# Altium project Main.PrjPCB
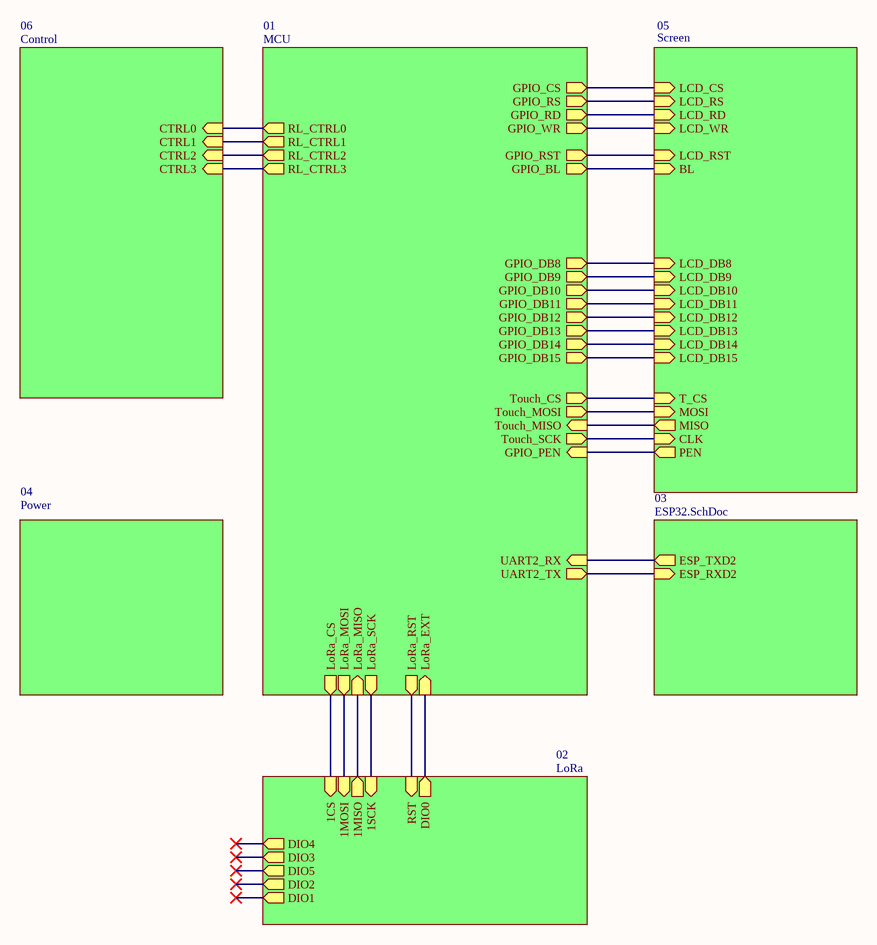
[diagram p0: Main.SchDoc]
7 sheets, 88 parts. Net scope: hierarchical (ports join the sheet entries above them; power ports are global).
Board file: GATEWAY_PCB.PcbDoc
Sheets:
  Main.SchDoc
    01 = MCU.SchDoc
    02 = LoRa.SchDoc
    04 = Power.SchDoc
    05 = Screen.SchDoc
    03 = ESP32.SchDoc
    06 = Control.SchDoc

## Sheet Main.SchDoc: =ProjectName
size A4; CheckedBy: DatNB; Author: Ven; CompanyName: Nacentech; Organization: IMET

### Sub-sheets
01 = MCU: GPIO_DB10 (out), GPIO_PEN (in), GPIO_DB13 (out), UART2_RX (in), GPIO_DB12 (out), LoRa_EXT (in), GPIO_WR (out), GPIO_RD (out), LoRa_RST (out), GPIO_DB14 (out), LoRa_CS (out), GPIO_BL (out), Touch_CS (out), Touch_SCK (out), GPIO_CS (out), LoRa_MOSI (out), LoRa_SCK (out), Touch_MOSI (out), GPIO_DB8 (out), LoRa_MISO (in), GPIO_RST (out), GPIO_DB15 (out), UART2_TX (out), GPIO_DB11 (out), GPIO_DB9 (out), GPIO_RS (out), Touch_MISO (in), RL_CTRL3 (out), RL_CTRL0 (out), RL_CTRL1 (out), RL_CTRL2 (out)
02 = LoRa: 1MOSI (in), DIO5 (out), DIO3 (out), DIO4 (out), DIO2 (out), 1SCK (in), DIO1 (out), DIO0 (out), RST (in), 1CS (in), 1MISO (out)
03 = ESP32.SchDoc: ESP_TXD2 (out), ESP_RXD2 (in)
04 = Power: no entries
05 = Screen: CLK (in), LCD_DB15 (in), MISO (out), T_CS (in), LCD_DB12 (in), LCD_DB9 (in), LCD_DB13 (in), BL (in), LCD_RS (in), LCD_DB10 (in), LCD_DB8 (in), PEN (out), LCD_RD (in), MOSI (in), LCD_DB14 (in), LCD_DB11 (in), LCD_WR (in), LCD_RST (in), LCD_CS (in)
06 = Control: CTRL0 (in), CTRL2 (in), CTRL1 (in), CTRL3 (in)

### Nets
NetJ6_1: sheet 01/GPIO_CS, sheet 05/LCD_CS
NetJ6_2: sheet 01/GPIO_WR, sheet 05/LCD_WR
NetJ6_3: sheet 01/GPIO_RST, sheet 05/LCD_RST
NetJ6_8: sheet 01/GPIO_DB9, sheet 05/LCD_DB9
NetJ6_9: sheet 01/GPIO_DB11, sheet 05/LCD_DB11
NetJ6_10: sheet 01/GPIO_DB13, sheet 05/LCD_DB13
NetJ6_11: sheet 01/GPIO_DB15, sheet 05/LCD_DB15
NetJ6_12: sheet 01/GPIO_BL, sheet 05/BL
NetJ6_15: sheet 01/Touch_MISO, sheet 05/MISO
NetJ6_16: sheet 01/GPIO_PEN, sheet 05/PEN
NetJ6_17: sheet 01/Touch_CS, sheet 05/T_CS
NetJ6_18: sheet 01/Touch_SCK, sheet 05/CLK
NetJ6_20: sheet 01/Touch_MOSI, sheet 05/MOSI
NetJ6_25: sheet 01/GPIO_DB14, sheet 05/LCD_DB14
NetJ6_26: sheet 01/GPIO_DB12, sheet 05/LCD_DB12
NetJ6_27: sheet 01/GPIO_DB10, sheet 05/LCD_DB10
NetJ6_28: sheet 01/GPIO_DB8, sheet 05/LCD_DB8
NetJ6_33: sheet 01/GPIO_RD, sheet 05/LCD_RD
NetJ6_34: sheet 01/GPIO_RS, sheet 05/LCD_RS
NetR14_1: sheet 01/RL_CTRL0, sheet 06/CTRL0
NetR15_1: sheet 01/RL_CTRL1, sheet 06/CTRL1
NetR18_1: sheet 01/RL_CTRL2, sheet 06/CTRL2
NetR19_1: sheet 01/RL_CTRL3, sheet 06/CTRL3
NetU1_27: sheet 01/UART2_TX, sheet 03/ESP_RXD2
NetU1_28: sheet 01/UART2_RX, sheet 03/ESP_TXD2
NetU2_4: sheet 01/LoRa_RST, sheet 02/RST
NetU2_5: sheet 01/LoRa_EXT, sheet 02/DIO0
NetU2_12: sheet 01/LoRa_SCK, sheet 02/1SCK
NetU2_13: sheet 01/LoRa_MISO, sheet 02/1MISO
NetU2_14: sheet 01/LoRa_MOSI, sheet 02/1MOSI
NetU2_15: sheet 01/LoRa_CS, sheet 02/1CS

### Notes on the sheet
- Project:
- Page Contents:
- Size:
- Date:
- A4
- Checked by:
- Time:
- Revision:
- Sheet
- of
- File:

## Sheet MCU.SchDoc: =ProjectName
size A4; CheckedBy: DatNB; Author: Ven; CompanyName: Nacentech; Organization: IMET
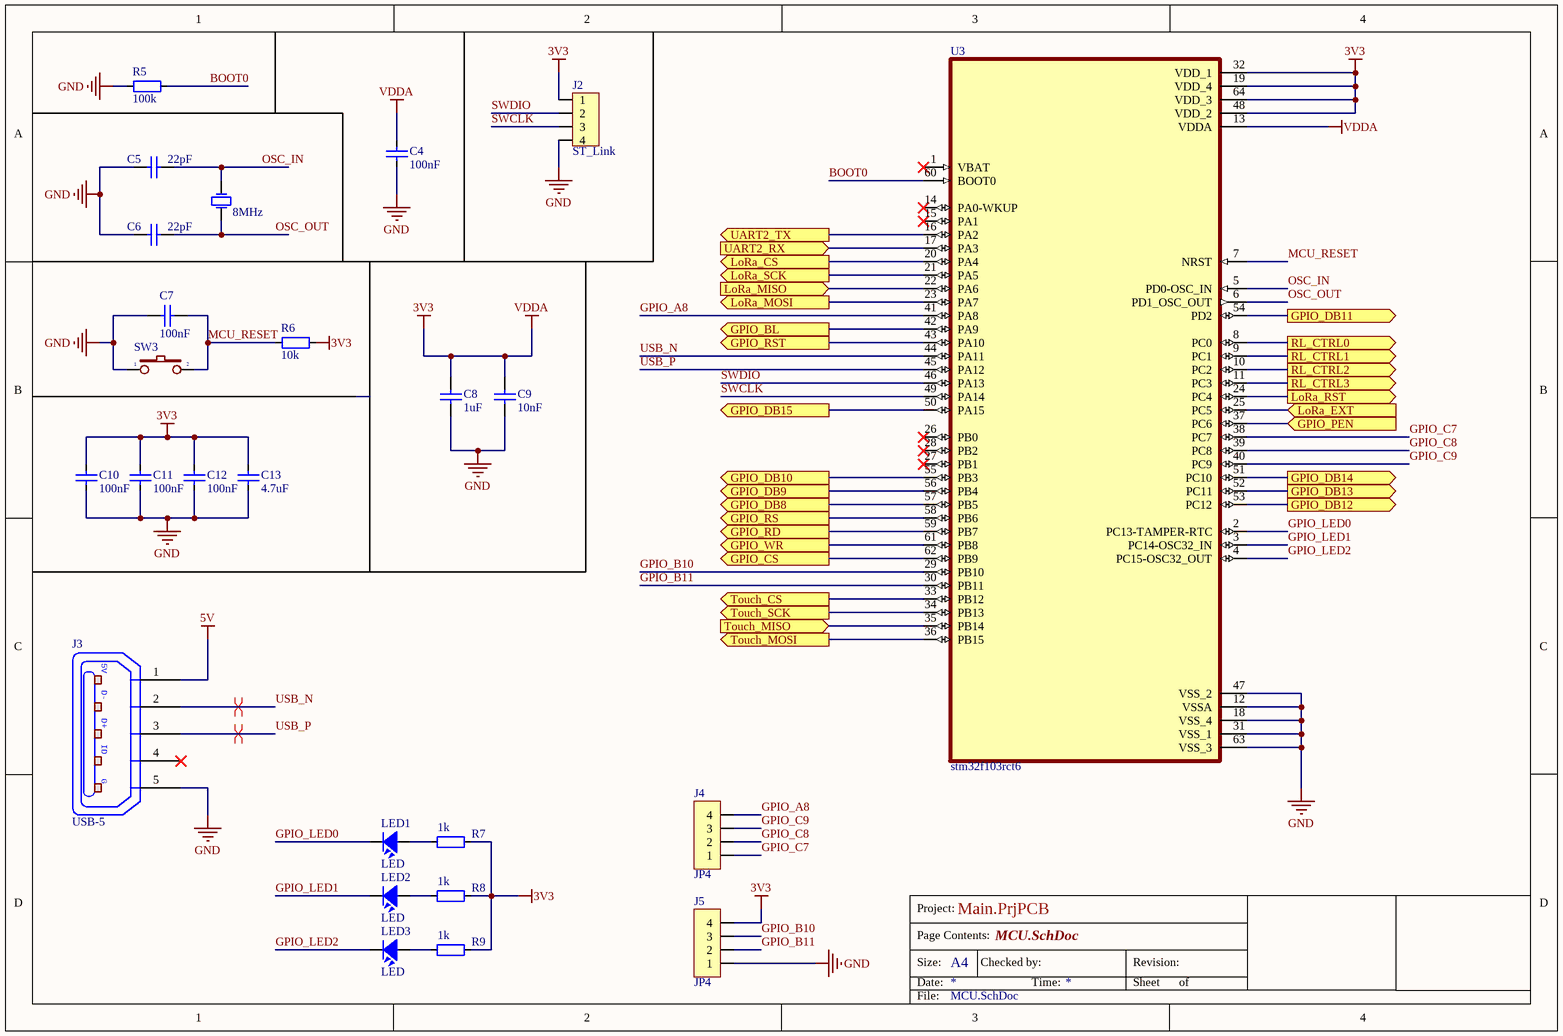
[diagram p1: MCU.SchDoc]

### Parts
C4  100nF  [CAP_0805]
C5  22pF  [CAP_0805]
C6  22pF  [CAP_0805]
C7  100nF  [CAP_0805]
C8  1uF  [CAP_0805]
C9  10nF  [CAP_0805]
C10  100nF  [CAP_0805]
C11  100nF  [CAP_0805]
C12  100nF  [CAP_0805]
C13  4.7uF  [CAP_0805]
J2  ST_Link  [JP4-C1T]
J3  USB-5  [USB-M1]
J4  JP4  [JP4-C1T]
J5  JP4  [JP4-C1T]
LED1  LED  [LED-0805-Red]
LED2  LED  [LED-0805-Green]
LED3  LED  [LED-0805-Blue]
R5  100k  [RES-SMD-0805]
R6  10k  [RES-SMD-0805]
R7  1k  [RES-SMD-0805]
R8  1k  [RES-SMD-0805]
R9  1k  [RES-SMD-0805]
SW3  SW  [SW2]  (value not drawn)
U3  stm32f103rct6  [QFP50P1200X1200X160-64N]
Y1  8MHz  [XTAL]

### Ports
GPIO_BL (out), GPIO_CS (out), GPIO_DB8 (out), GPIO_DB9 (out), GPIO_DB10 (out), GPIO_DB11 (out), GPIO_DB12 (out), GPIO_DB13 (out), GPIO_DB14 (out), GPIO_DB15 (out), GPIO_PEN (in), GPIO_RD (out), GPIO_RS (out), GPIO_RST (out), GPIO_WR (out), LoRa_CS (out), LoRa_EXT (in), LoRa_MISO (in), LoRa_MOSI (out), LoRa_RST (out), LoRa_SCK (out), RL_CTRL0 (out), RL_CTRL1 (out), RL_CTRL2 (out), RL_CTRL3 (out), Touch_CS (out), Touch_MISO (in), Touch_MOSI (out), Touch_SCK (out), UART2_RX (in), UART2_TX (out)

### Nets
3V3: C4.2 C8.2 C9.2 C10.2 C11.2 C12.2 C13.2 J2.1 J5.4 R6.1 R7.1 R8.1 R9.1 U3.13(VDDA) U3.19(VDD_4) U3.32(VDD_1) U3.48(VDD_2) U3.64(VDD_3)  [also labelled VDDA]
5V: J3.1(P1)
GND: C4.1 C5.1 C6.1 C7.1 C8.1 C9.1 C10.1 C11.1 C12.1 C13.1 J2.4 J3.5(P5) J5.1 R5.2 SW3.1 U3.12(VSSA) U3.18(VSS_4) U3.31(VSS_1) U3.47(VSS_2) U3.63(VSS_3)
BOOT0: R5.1 U3.60(BOOT0)
GPIO_A8: J4.4 U3.41(PA8)
GPIO_B10: J5.3 U3.29(PB10)
GPIO_B11: J5.2 U3.30(PB11)
GPIO_C7: J4.1 U3.38(PC7)
GPIO_C8: J4.2 U3.39(PC8)
GPIO_C9: J4.3 U3.40(PC9)
GPIO_LED0: LED1.2 U3.2(PC13-TAMPER-RTC)
GPIO_LED1: LED2.2 U3.3(PC14-OSC32_IN)
GPIO_LED2: LED3.2 U3.4(PC15-OSC32_OUT)
MCU_RESET: C7.2 R6.2 SW3.2 U3.7(NRST)
OSC_IN: C5.2 U3.5(PD0-OSC_IN) Y1.1(OSC1)
OSC_OUT: C6.2 U3.6(PD1_OSC_OUT) Y1.2(OSC2)
SWCLK: J2.3 U3.49(PA14)
SWDIO: J2.2 U3.46(PA13)
USB_N: J3.2(P2) U3.44(PA11)
USB_P: J3.3(P3) U3.45(PA12)
NetJ6_1: U3.62(PB9) ; port GPIO_CS
NetJ6_2: U3.61(PB8) ; port GPIO_WR
NetJ6_3: U3.43(PA10) ; port GPIO_RST
NetJ6_8: U3.56(PB4) ; port GPIO_DB9
NetJ6_9: U3.54(PD2) ; port GPIO_DB11
NetJ6_10: U3.52(PC11) ; port GPIO_DB13
NetJ6_11: U3.50(PA15) ; port GPIO_DB15
NetJ6_12: U3.42(PA9) ; port GPIO_BL
NetJ6_15: U3.35(PB14) ; port Touch_MISO
NetJ6_16: U3.37(PC6) ; port GPIO_PEN
NetJ6_17: U3.33(PB12) ; port Touch_CS
NetJ6_18: U3.34(PB13) ; port Touch_SCK
NetJ6_20: U3.36(PB15) ; port Touch_MOSI
NetJ6_25: U3.51(PC10) ; port GPIO_DB14
NetJ6_26: U3.53(PC12) ; port GPIO_DB12
NetJ6_27: U3.55(PB3) ; port GPIO_DB10
NetJ6_28: U3.57(PB5) ; port GPIO_DB8
NetJ6_33: U3.59(PB7) ; port GPIO_RD
NetJ6_34: U3.58(PB6) ; port GPIO_RS
NetLED1_1: LED1.1 R7.2
NetLED2_1: LED2.1 R8.2
NetLED3_1: LED3.1 R9.2
NetR14_1: U3.8(PC0) ; port RL_CTRL0
NetR15_1: U3.9(PC1) ; port RL_CTRL1
NetR18_1: U3.10(PC2) ; port RL_CTRL2
NetR19_1: U3.11(PC3) ; port RL_CTRL3
NetU1_27: U3.16(PA2) ; port UART2_TX
NetU1_28: U3.17(PA3) ; port UART2_RX
NetU2_4: U3.24(PC4) ; port LoRa_RST
NetU2_5: U3.25(PC5) ; port LoRa_EXT
NetU2_12: U3.21(PA5) ; port LoRa_SCK
NetU2_13: U3.22(PA6) ; port LoRa_MISO
NetU2_14: U3.23(PA7) ; port LoRa_MOSI
NetU2_15: U3.20(PA4) ; port LoRa_CS

Not connected (* = marked no-connect by the designer): J3 4(P4)*; U3 1(VBAT)* 14(PA0-WKUP)* 15(PA1)* 26(PB0)* 27(PB1)* 28(PB2)*

### Layout directives
differential pair: USB_N, USB_P

### Notes on the sheet
- Project:
- Page Contents:
- Size:
- Date:
- A4
- Checked by:
- Time:
- Revision:
- Sheet
- of
- File:
- (in symbol USB-5) 5V; D-; D+; ID; G

### Library data of the parts
C4-C13 = CapSMD: Capacitor; Value: 33p; Published: 8-Jun-2000; LatestRevisionDate: 17-Jul-2002; LatestRevisionNote: Re-released for DXP Platform.; PackageReference: RAD-0.3; Publisher: Altium Limited
J2 = Header4: Header IDC, 4 x 1 Pin Vertical 2.54mm Pitch (Non-Boxed, Male); Manufacturer: W¨¹rth Elektronik eiSos GmbH; partNo: 613002143121; ComponentLink1 Description: Manufacturer; ComponentLink2 Description: Datasheet; NoPins: 02; Created Date: 29 March 2013; ComponentLink1URL: http://www.we-online.com; ComponentLink2URL: http://katalog.we-online.de/em/datasheet/6130xx143121.pdf; Created by: Karrer Zheng
J3 = USB-5: Manufacturer: FCI; Manufacturer Part Number: 10118193-0001LF; Connector Type: USB - micro B; Number of Contacts: 5; Gender: Receptacle; Specifications: USB 2.0; .Creator: MM; .Checked PCB: RF; Supplier 1: Digi-Key; RoHS: RoHS Compliant; Category: Connectors, Interconnects; Stock 1: 28642; Pricing 1: 1=0.46, 10=0.433, 25=0.3712, 50=0.3156, 100=0.3032, 250=0.27224, 500=0.25988 (USD); Packaging: Cut Tape (CT); Mounting Type: Surface Mount, Right Angle, Horizontal; Features: Shielded, Solder Retention; Ingress Protection: -; ComponentLink1URL: http://portal.fciconnect.com/Comergent//fci/drawing/10118193.pdf; ComponentLink1Description: http://portal.fciconnect.com/Comergent//fci/drawing/10118193.pdf; Supplier Part Number 1: 609-4616-1-ND; .Checked SCH: MM
J4 J5 = JP4: WR-PHD 2.54 mm Angled Socket Header; Manufacturer: W¨¹rth Elektronik eiSos GmbH; partNo: 613004143121; ComponentLink1 Description: Manufacturer; ComponentLink2 Description: Datasheet; NoPins: 04; Created Date: 29 March 2013; ComponentLink1URL: http://www.we-online.com; ComponentLink2URL: http://katalog.we-online.de/em/datasheet/6130xx143121.pdf; Created by: Karrer Zheng
LED1-LED3 = LED: LED Single colour Green and Red; Value: LED 3 ly Single Colour
R5-R9 = Resistor - SMD: Resistor; Manufacturer: Generic Components; Class: Passive; Published: 08/06/2000; Publisher: Altium Hobart Technology Centre
SW3 = SW2: Switch button 2 pin; Value: SW chip 2 pin
Y1 = XTAL: Crystal Oscillator; Published: 8-Jun-2000; LatestRevisionDate: 17-Jul-2002; LatestRevisionNote: Re-released for DXP Platform.; PackageReference: R38; Publisher: Altium Limited

## Sheet LoRa.SchDoc: =ProjectName
size A4; CheckedBy: DatNB; Author: Ven; CompanyName: Nacentech; Organization: IMET
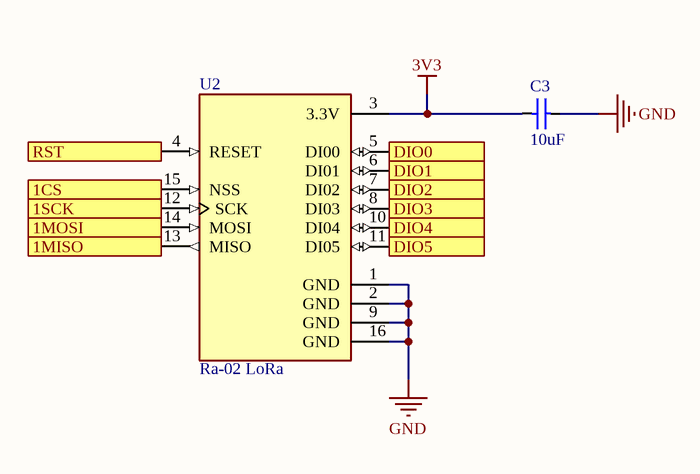
[diagram p2: LoRa.SchDoc]

### Parts
C3  10uF  [CAP_0805]
U2  Ra-02 LoRa  [Ra-02]

### Ports
1CS (in), 1MISO (out), 1MOSI (in), 1SCK (in), DIO0 (out), DIO1 (out), DIO2 (out), DIO3 (out), DIO4 (out), DIO5 (out), RST (in)

### Nets
3V3: C3.2 U2.3(3.3V)
GND: C3.1 U2.1(GND) U2.2(GND) U2.9(GND) U2.16(GND)
NetU2_4: U2.4(RESET) ; port RST
NetU2_5: U2.5(DI00) ; port DIO0
NetU2_6: U2.6(DI01) ; port DIO1
NetU2_7: U2.7(DI02) ; port DIO2
NetU2_8: U2.8(DI03) ; port DIO3
NetU2_10: U2.10(DI04) ; port DIO4
NetU2_11: U2.11(DI05) ; port DIO5
NetU2_12: U2.12(SCK) ; port 1SCK
NetU2_13: U2.13(MISO) ; port 1MISO
NetU2_14: U2.14(MOSI) ; port 1MOSI
NetU2_15: U2.15(NSS) ; port 1CS

### Notes on the sheet
- Project:
- Page Contents:
- Size:
- Date:
- A4
- Checked by:
- Time:
- Revision:
- Sheet
- of
- File:

### Library data of the parts
C3 = CapSMD: Capacitor; Value: 33p; Published: 8-Jun-2000; LatestRevisionDate: 17-Jul-2002; LatestRevisionNote: Re-released for DXP Platform.; PackageReference: RAD-0.3; Publisher: Altium Limited
U2 = Ra-02 LoRa: LoRa Module Ra-02

## Sheet Power.SchDoc: =ProjectName
size A4; CheckedBy: DatNB; Author: Ven; CompanyName: Nacentech; Organization: IMET
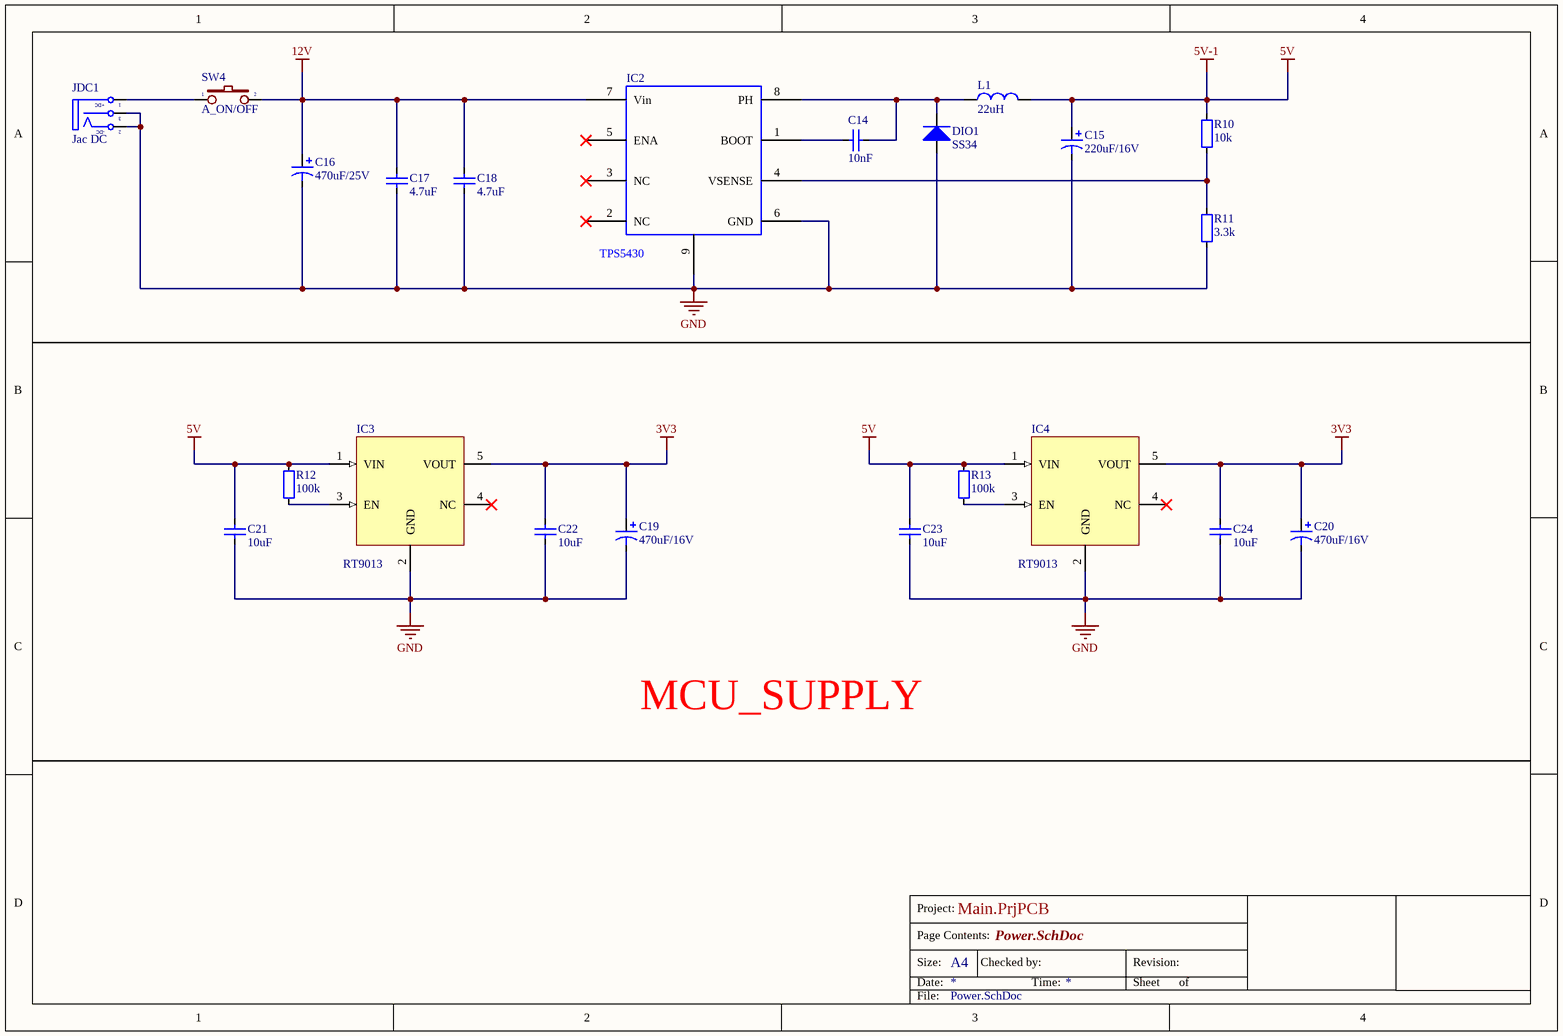
[diagram p3: Power.SchDoc]

### Parts
C14  10nF  [CAP_0805]
C15  220uF/16V  [C8mm]
C16  470uF/25V  [C8mm]
C17  4.7uF  [CAP_0805]
C18  4.7uF  [CAP_0805]
C19  470uF/16V  [C8mm]
C20  470uF/16V  [C8mm]
C21  10uF  [CAP_0805]
C22  10uF  [CAP_0805]
C23  10uF  [CAP_0805]
C24  10uF  [CAP_0805]
DIO1  SS34  [DIO-SMD-106]
IC2  TPS5430  [TPS5430-2]
IC3  RT9013  [SOT23-5]
IC4  RT9013  [SOT23-5]
JDC1  Jac DC  [DC-IN]
L1  22uH  [L-SMD-M-7.3x4.5]
R10  10k  [RES-SMD-0805]
R11  3.3k  [RES-SMD-0805]
R12  100k  [RES-SMD-0805]
R13  100k  [RES-SMD-0805]
SW4  A_ON/OFF  [SW2]

### Nets
3V3: C19.1 C20.1 C22.2 C24.2 IC3.5(VOUT) IC4.5(VOUT)
5V: C15.1 C21.2 C23.2 IC3.1(VIN) IC4.1(VIN) L1.2 R10.2 R12.1 R13.1  [also labelled 5V-1]
12V: C16.1 C17.2 C18.2 IC2.7(Vin) SW4.2
GND: C15.2 C16.2 C17.1 C18.1 C19.2 C20.2 C21.1 C22.1 C23.1 C24.1 DIO1.1(A) IC2.6(GND) IC2.9(PWR_PAD) IC3.2(GND) IC4.2(GND) JDC1.2(TN) JDC1.3(S) R11.1
NetC14_1: C14.1 DIO1.2(K) IC2.8(PH) L1.1
NetC14_2: C14.2 IC2.1(BOOT)
NetIC2_4: IC2.4(VSENSE) R10.1 R11.2
NetIC3_3: IC3.3(EN) R12.2
NetIC4_3: IC4.3(EN) R13.2
NetJDC1_1: JDC1.1(T) SW4.1

Not connected (* = marked no-connect by the designer): IC2 2(NC)* 3(NC)* 5(ENA)*; IC3 4(NC)*; IC4 4(NC)*

### Notes on the sheet
- MCU_SUPPLY
- Project:
- Page Contents:
- Size:
- Date:
- A4
- Checked by:
- Time:
- Revision:
- Sheet
- of
- File:
- (in symbol DCIN) +DC; -DC

### Library data of the parts
C14 C17 C18 C21-C24 = CapSMD: Capacitor; Value: 33p; Published: 8-Jun-2000; LatestRevisionDate: 17-Jul-2002; LatestRevisionNote: Re-released for DXP Platform.; PackageReference: RAD-0.3; Publisher: Altium Limited
C15 C16 C19 C20 = Cap Pol: Polarized Capacitor (Axial); Published: 8-Jun-2000; LatestRevisionDate: 17-Jul-2002; LatestRevisionNote: Re-released for DXP Platform.; PackageReference: POLAR0.8; Publisher: Altium Limited
DIO1 = Diode SMD: Default Diode; Code - JEDEC: DO-214-AB; Value: 1N5007; Published: 8-Jun-2000; Revision: July-2002: Re-released for DXP Platform.; Publisher: Altium Limited
IC3 IC4 = RT9013: RT9013-33GB IC REG LINEAR 3.3V 500mA SOT23-5
JDC1 = DCIN: Jac DC input; Value: Jac DC
L1 = Inductor: Value: 150 mH
R10-R13 = Resistor - SMD: as R5 on sheet MCU; Published: 08/06/2000; Publisher: Altium Hobart Technology Centre
SW4 = SW2: as SW3 on sheet MCU
IC2 = TPS5430: Name: TPS5430

## Sheet Screen.SchDoc: =ProjectName
size A4; CheckedBy: DatNB; Author: Ven; CompanyName: Nacentech; Organization: IMET
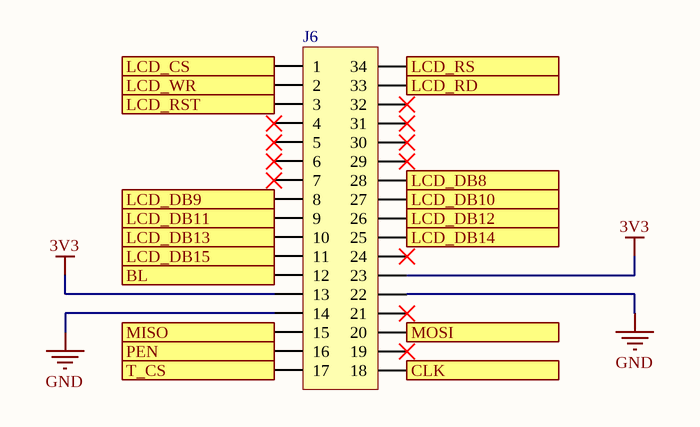
[diagram p4: Screen.SchDoc]

### Parts
J6  JP17x2  [JP17-C2T]  (value not drawn)

### Ports
BL (in), CLK (in), LCD_CS (in), LCD_DB8 (in), LCD_DB9 (in), LCD_DB10 (in), LCD_DB11 (in), LCD_DB12 (in), LCD_DB13 (in), LCD_DB14 (in), LCD_DB15 (in), LCD_RD (in), LCD_RS (in), LCD_RST (in), LCD_WR (in), MISO (out), MOSI (in), PEN (out), T_CS (in)

### Nets
3V3: J6.13 J6.23
GND: J6.14 J6.22
NetJ6_1: J6.1 ; port LCD_CS
NetJ6_2: J6.2 ; port LCD_WR
NetJ6_3: J6.3 ; port LCD_RST
NetJ6_8: J6.8 ; port LCD_DB9
NetJ6_9: J6.9 ; port LCD_DB11
NetJ6_10: J6.10 ; port LCD_DB13
NetJ6_11: J6.11 ; port LCD_DB15
NetJ6_12: J6.12 ; port BL
NetJ6_15: J6.15 ; port MISO
NetJ6_16: J6.16 ; port PEN
NetJ6_17: J6.17 ; port T_CS
NetJ6_18: J6.18 ; port CLK
NetJ6_20: J6.20 ; port MOSI
NetJ6_25: J6.25 ; port LCD_DB14
NetJ6_26: J6.26 ; port LCD_DB12
NetJ6_27: J6.27 ; port LCD_DB10
NetJ6_28: J6.28 ; port LCD_DB8
NetJ6_33: J6.33 ; port LCD_RD
NetJ6_34: J6.34 ; port LCD_RS

Not connected (* = marked no-connect by the designer): J6 4* 5* 6* 7* 19* 21* 24* 29* 30* 31* 32*

### Notes on the sheet
- Project:
- Page Contents:
- Size:
- Date:
- A4
- Checked by:
- Time:
- Revision:
- Sheet
- of
- File:

### Library data of the parts
J6 = JP17x2: WR-PHD 2.54 mm Dual Socket Header; Manufacturer: W¨¹rth Elektronik eiSos GmbH; partNo: 61303421821; ComponentLink1 Description: Manufacturer; ComponentLink2 Description: Datasheet; NoPins: 34; Created Date: 29 March 2013; ComponentLink1URL: http://www.we-online.com; ComponentLink2URL: http://katalog.we-online.de/em/datasheet/6130xx21821.pdf; Created by: Karrer Zheng

## Sheet ESP32.SchDoc: =ProjectName
size A4; CheckedBy: DatNB; Author: Ven; CompanyName: Nacentech; Organization: IMET
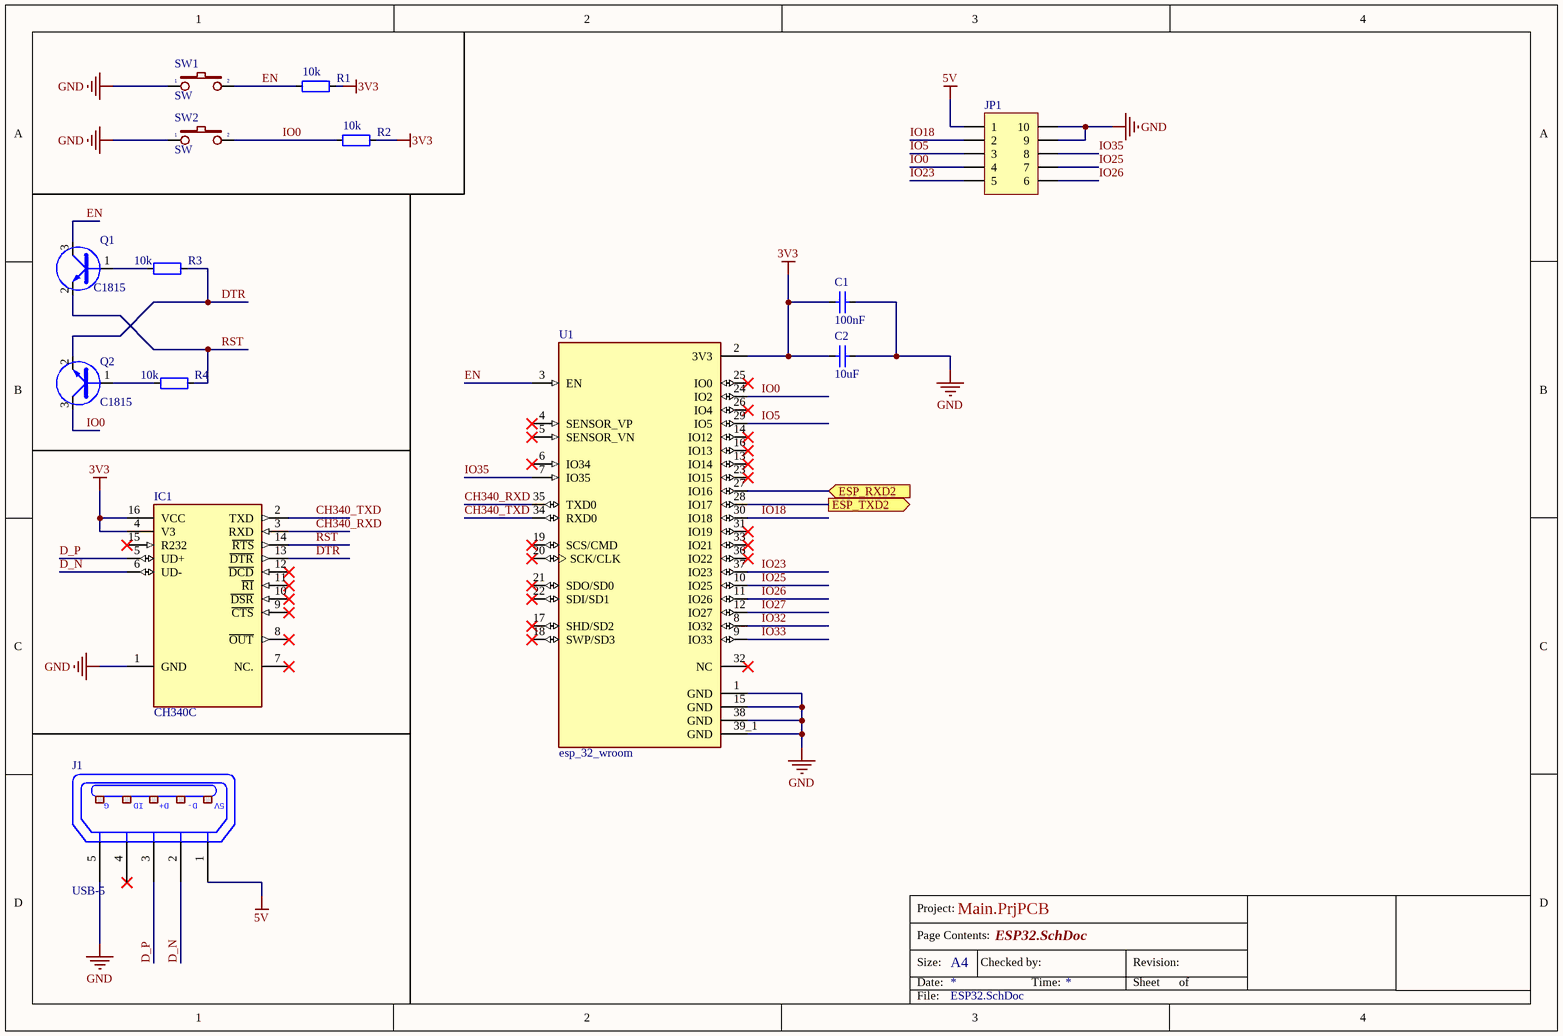
[diagram p5: ESP32.SchDoc]

### Parts
C1  100nF  [CAP_0805]
C2  10uF  [CAP_0805]
IC1  CH340C  [SO16]
J1  USB-5  [USB-M1]
JP1  JP 2x5 2.54  [JP5-D2T]  (value not drawn)
Q1  C1815  [SOT23D]
Q2  C1815  [SOT23D]
R1  10k  [RES-SMD-0805]
R2  10k  [RES-SMD-0805]
R3  10k  [RES-SMD-0805]
R4  10k  [RES-SMD-0805]
SW1  SW  [SW2]
SW2  SW  [SW2]
U1  esp_32_wroom  [MODULE_ESP32-WROOM-32]

### Ports
ESP_RXD2 (in), ESP_TXD2 (out)

### Nets
3V3: C1.1 C2.1 IC1.4(V3) IC1.16(VCC) R1.1 R2.1 U1.2(3V3)
5V: J1.1(P1) JP1.1
GND: C1.2 C2.2 IC1.1(GND) J1.5(P5) JP1.9 JP1.10 SW1.1 SW2.1 U1.1(GND) U1.15(GND) U1.38(GND) U1.39_1(GND)
CH340_RXD: IC1.3(RXD) U1.35(TXD0)
CH340_TXD: IC1.2(TXD) U1.34(RXD0)
D_N: IC1.6(UD-) J1.2(P2)
D_P: IC1.5(UD+) J1.3(P3)
DTR: IC1.13(~{DTR}) Q2.2(E) R3.1
EN: Q1.3(C) R1.2 SW1.2 U1.3(EN)
IO0: JP1.4 Q2.3(C) R2.2 SW2.2 U1.24(IO2)
IO5: JP1.3 U1.29(IO5)
IO18: JP1.2 U1.30(IO18)
IO23: JP1.5 U1.37(IO23)
IO25: JP1.7 U1.10(IO25)
IO26: JP1.6 U1.11(IO26)
IO27: U1.12(IO27)
IO32: U1.8(IO32)
IO33: U1.9(IO33)
IO35: JP1.8 U1.7(IO35)
RST: IC1.14(~{RTS}) Q1.2(E) R4.1
NetQ1_1: Q1.1(B) R3.2
NetQ2_1: Q2.1(B) R4.2
NetU1_27: U1.27(IO16) ; port ESP_RXD2
NetU1_28: U1.28(IO17) ; port ESP_TXD2

Not connected (* = marked no-connect by the designer): IC1 7(NC.)* 8(~{OUT})* 9(~{CTS})* 10(~{DSR})* 11(~{RI})* 12(~{DCD})* 15(R232)*; J1 4(P4)*; U1 4(SENSOR_VP)* 5(SENSOR_VN)* 6(IO34)* 13(IO14)* 14(IO12)* 16(IO13)* 17(SHD/SD2)* 18(SWP/SD3)* 19(SCS/CMD)* 20(SCK/CLK)* 21(SDO/SD0)* 22(SDI/SD1)* 23(IO15)* 25(IO0)* 26(IO4)* 31(IO19)* 32(NC)* 33(IO21)* 36(IO22)*

### Notes on the sheet
- Project:
- Page Contents:
- Size:
- Date:
- A4
- Checked by:
- Time:
- Revision:
- Sheet
- of
- File:
- (in symbol USB-5) G; ID; D+; D-; 5V

### Library data of the parts
C1 C2 = CapSMD: Capacitor; Value: 33p; Published: 8-Jun-2000; LatestRevisionDate: 17-Jul-2002; LatestRevisionNote: Re-released for DXP Platform.; PackageReference: RAD-0.3; Publisher: Altium Limited
J1 = USB-5: as J3 on sheet MCU; Supplier 1: Digi-Key; RoHS: RoHS Compliant; Category: Connectors, Interconnects; Stock 1: 28642; Pricing 1: 1=0.46, 10=0.433, 25=0.3712, 50=0.3156, 100=0.3032, 250=0.27224, 500=0.25988 (USD); Packaging: Cut Tape (CT); Mounting Type: Surface Mount, Right Angle, Horizontal; Features: Shielded, Solder Retention; Ingress Protection: -; ComponentLink1URL: http://portal.fciconnect.com/Comergent//fci/drawing/10118193.pdf; ComponentLink1Description: http://portal.fciconnect.com/Comergent//fci/drawing/10118193.pdf; Supplier Part Number 1: 609-4616-1-ND; .Checked SCH: MM
JP1 = JP 2x5 2.54 Duc Thang: Cắm; Ten_Linh_Kien: Jump Đôi Đực 2.54MM 2x40P Thẳng 11MM; Don_Vi: Con; Ma_Hang: MH002686; Ghi_Chu: *; Kieu_Chan: *; Chung_Loai: Cắm
Q1 Q2 = 2SC1815: NPN 600mW, ECB; Value: C1815
R1-R4 = Resistor - SMD: as R5 on sheet MCU; Published: 08/06/2000; Publisher: Altium Hobart Technology Centre
SW1 SW2 = SW2: as SW3 on sheet MCU

## Sheet Control.SchDoc: =ProjectName
size A4; CheckedBy: DatNB; Author: Ven; CompanyName: Nacentech; Organization: IMET
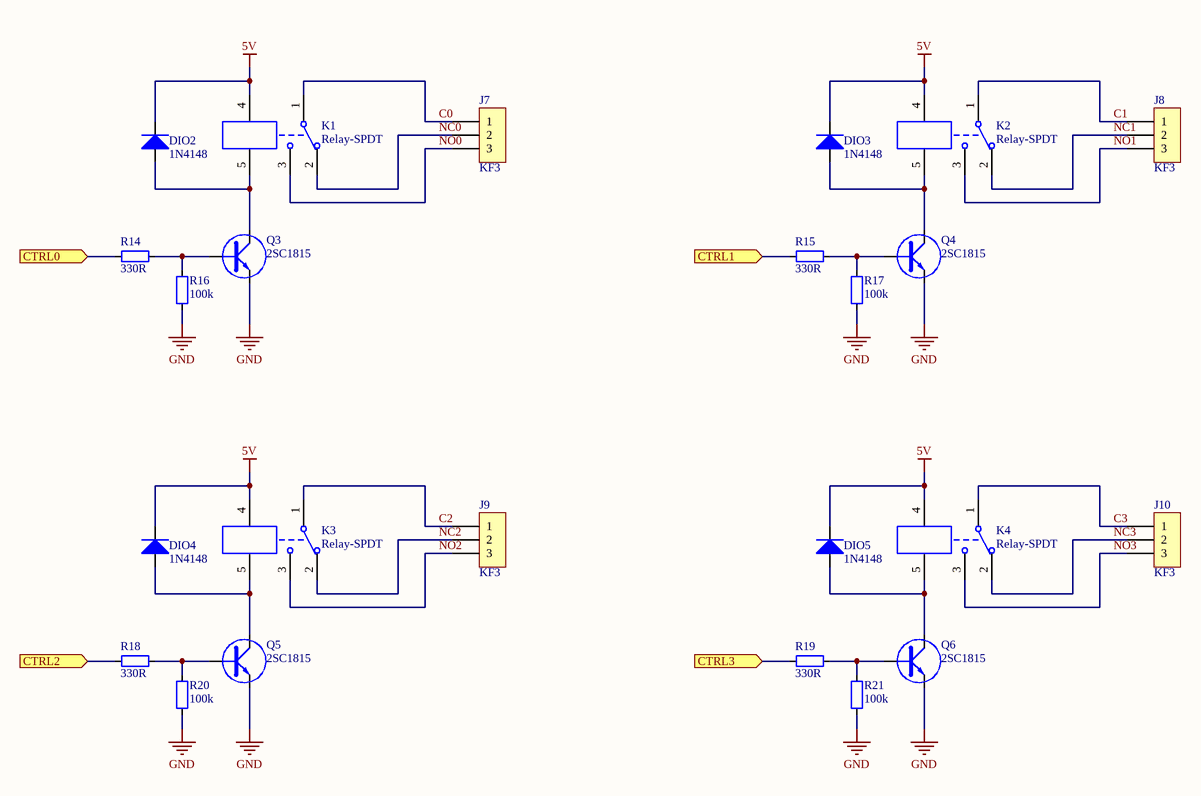
[diagram p6: Control.SchDoc]

### Parts
DIO2  1N4148  [DIO-SMD-106]
DIO3  1N4148  [DIO-SMD-106]
DIO4  1N4148  [DIO-SMD-106]
DIO5  1N4148  [DIO-SMD-106]
J7  KF3  [KF3-5.08]
J8  KF3  [KF3-5.08]
J9  KF3  [KF3-5.08]
J10  KF3  [KF3-5.08]
K1  Relay-SPDT  [RELAY5PIN-10A]
K2  Relay-SPDT  [RELAY5PIN-10A]
K3  Relay-SPDT  [RELAY5PIN-10A]
K4  Relay-SPDT  [RELAY5PIN-10A]
Q3  2SC1815  [SOT23]
Q4  2SC1815  [SOT23]
Q5  2SC1815  [SOT23]
Q6  2SC1815  [SOT23]
R14  330R  [RES-SMD-0805]
R15  330R  [RES-SMD-0805]
R16  100k  [RES-SMD-0805]
R17  100k  [RES-SMD-0805]
R18  330R  [RES-SMD-0805]
R19  330R  [RES-SMD-0805]
R20  100k  [RES-SMD-0805]
R21  100k  [RES-SMD-0805]

### Ports
CTRL0 (in), CTRL1 (in), CTRL2 (in), CTRL3 (in)

### Nets
5V: DIO2.2(K) DIO3.2(K) DIO4.2(K) DIO5.2(K) K1.4 K2.4 K3.4 K4.4
GND: Q3.3(E) Q4.3(E) Q5.3(E) Q6.3(E) R16.1 R17.1 R20.1 R21.1
C0: J7.1 K1.1
C1: J8.1 K2.1
C2: J9.1 K3.1
C3: J10.1 K4.1
NC0: J7.2 K1.2
NC1: J8.2 K2.2
NC2: J9.2 K3.2
NC3: J10.2 K4.2
NO0: J7.3 K1.3
NO1: J8.3 K2.3
NO2: J9.3 K3.3
NO3: J10.3 K4.3
NetDIO2_1: DIO2.1(A) K1.5 Q3.2(C)
NetDIO3_1: DIO3.1(A) K2.5 Q4.2(C)
NetDIO4_1: DIO4.1(A) K3.5 Q5.2(C)
NetDIO5_1: DIO5.1(A) K4.5 Q6.2(C)
NetQ3_1: Q3.1(B) R14.2 R16.2
NetQ4_1: Q4.1(B) R15.2 R17.2
NetQ5_1: Q5.1(B) R18.2 R20.2
NetQ6_1: Q6.1(B) R19.2 R21.2
NetR14_1: R14.1 ; port CTRL0
NetR15_1: R15.1 ; port CTRL1
NetR18_1: R18.1 ; port CTRL2
NetR19_1: R19.1 ; port CTRL3

### Notes on the sheet
- Project:
- Page Contents:
- Size:
- Date:
- A4
- Checked by:
- Time:
- Revision:
- Sheet
- of
- File:

### Library data of the parts
DIO2-DIO5 = Diode SMD: as DIO1 on sheet Power; Published: 8-Jun-2000; Revision: July-2002: Re-released for DXP Platform.; Publisher: Altium Limited
J7-J10 = KF3: Manufacturer: Würth Elektronik eiSos GmbH; partNo: 691103110003; ComponentLink1 Description: Manufacturer; ComponentLink2 Description: Datasheet; NoPins: 3; Created Date: 29 October 2013; ComponentLink1URL: http://www.we-online.com; ComponentLink2URL: http://katalog.we-online.de/em/datasheet/6911031100xx.pdf; Created by: Karrer Zheng
K1-K4 = Relay-SPDT: Single-Pole Dual-Throw Relay; Published: 24-Mar-1999; LatestRevisionDate: 17-Jul-2002; LatestRevisionNote: Re-released for DXP Platform.; PackageReference: MODULE5B; Publisher: Altium Limited
Q3-Q6 = 2SC1815: NPN 600mW, ECB; Value: C1815
R14-R21 = Resistor - SMD: as R5 on sheet MCU; Published: 08/06/2000; Publisher: Altium Hobart Technology Centre

## Nets that join several sheets
3V3: MCU (18 pins), LoRa (C3.2 U2.3), Power (6 pins), Screen (J6.13 J6.23), ESP32 (7 pins)
5V: MCU (J3.1), Power (9 pins), ESP32 (J1.1 JP1.1), Control (8 pins)
GND: MCU (20 pins), LoRa (5 pins), Power (18 pins), Screen (J6.14 J6.22), ESP32 (12 pins), Control (8 pins)
NetJ6_1: MCU (U3.62), Screen (J6.1)
NetJ6_2: MCU (U3.61), Screen (J6.2)
NetJ6_3: MCU (U3.43), Screen (J6.3)
NetJ6_8: MCU (U3.56), Screen (J6.8)
NetJ6_9: MCU (U3.54), Screen (J6.9)
NetJ6_10: MCU (U3.52), Screen (J6.10)
NetJ6_11: MCU (U3.50), Screen (J6.11)
NetJ6_12: MCU (U3.42), Screen (J6.12)
NetJ6_15: MCU (U3.35), Screen (J6.15)
NetJ6_16: MCU (U3.37), Screen (J6.16)
NetJ6_17: MCU (U3.33), Screen (J6.17)
NetJ6_18: MCU (U3.34), Screen (J6.18)
NetJ6_20: MCU (U3.36), Screen (J6.20)
NetJ6_25: MCU (U3.51), Screen (J6.25)
NetJ6_26: MCU (U3.53), Screen (J6.26)
NetJ6_27: MCU (U3.55), Screen (J6.27)
NetJ6_28: MCU (U3.57), Screen (J6.28)
NetJ6_33: MCU (U3.59), Screen (J6.33)
NetJ6_34: MCU (U3.58), Screen (J6.34)
NetR14_1: MCU (U3.8), Control (R14.1)
NetR15_1: MCU (U3.9), Control (R15.1)
NetR18_1: MCU (U3.10), Control (R18.1)
NetR19_1: MCU (U3.11), Control (R19.1)
NetU1_27: MCU (U3.16), ESP32 (U1.27)
NetU1_28: MCU (U3.17), ESP32 (U1.28)
NetU2_4: MCU (U3.24), LoRa (U2.4)
NetU2_5: MCU (U3.25), LoRa (U2.5)
NetU2_12: MCU (U3.21), LoRa (U2.12)
NetU2_13: MCU (U3.22), LoRa (U2.13)
NetU2_14: MCU (U3.23), LoRa (U2.14)
NetU2_15: MCU (U3.20), LoRa (U2.15)